# Altium project USB_Tool.PrjPcb
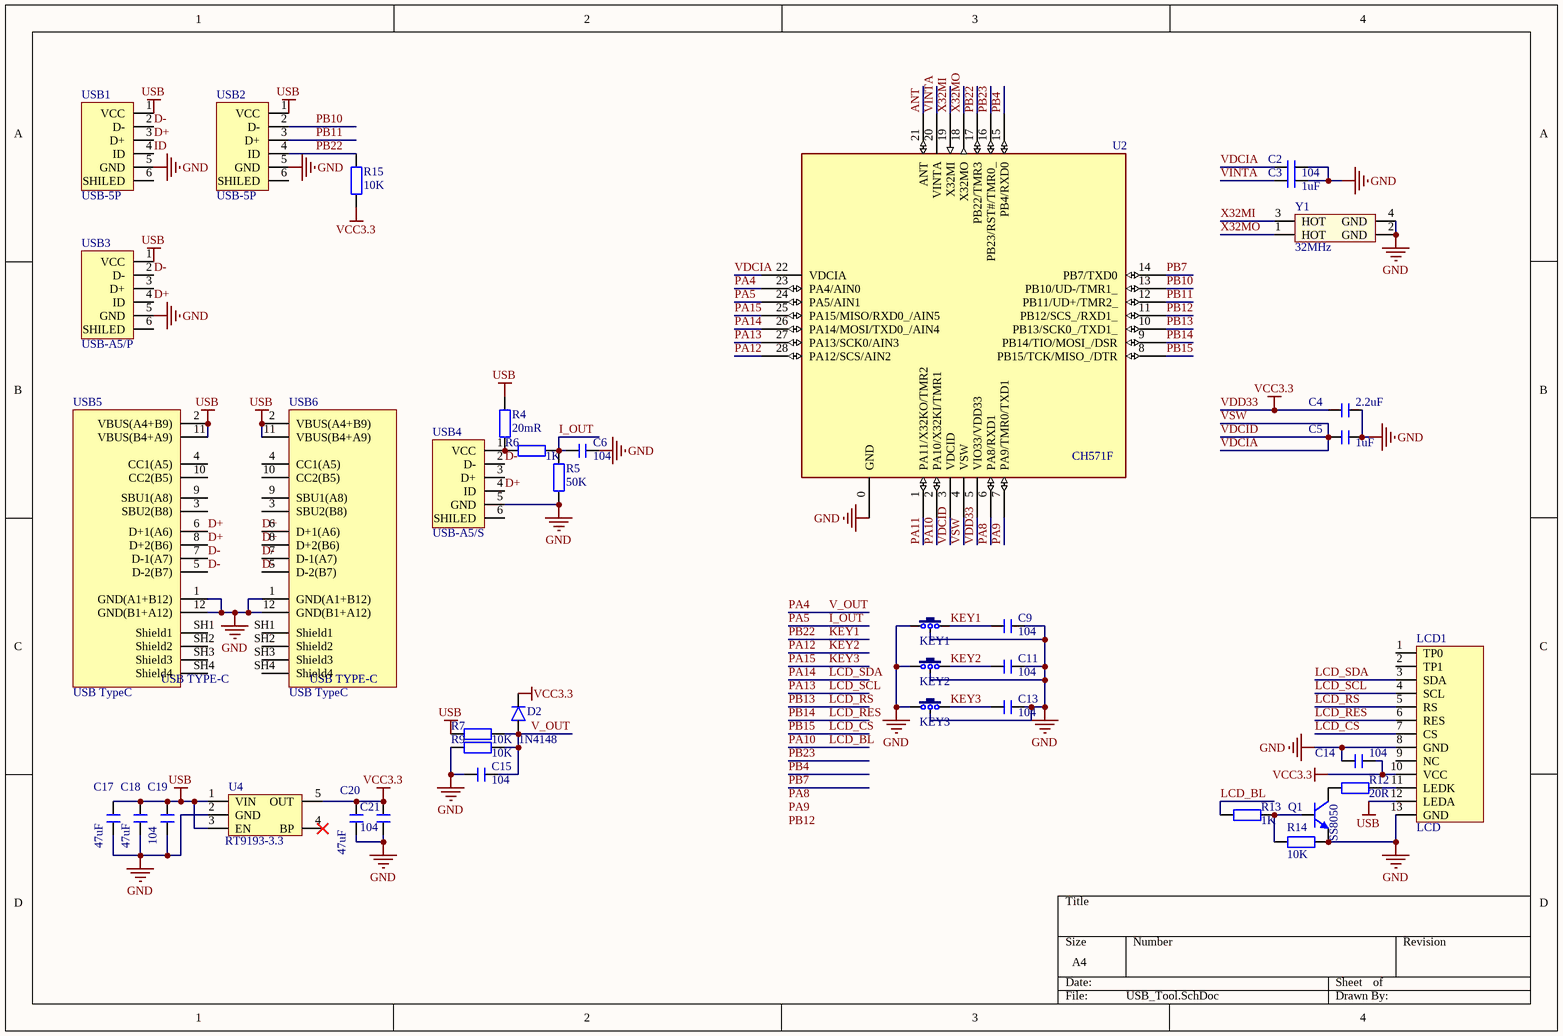
[diagram p0: USB_Tool.SchDoc]
1 sheet, 39 parts. Net scope: global (net labels, ports and power ports of the same name join across sheets).
Board file: USB_Tool.PcbDoc

## Sheet USB_Tool.SchDoc
size A4

### Parts
C2  104  [C 0603_L]
C3  1uF  [C 0603_L]
C4  2.2uF  [C 0603_L]
C5  1uF  [C 0603_L]
C6  104  [C 0603_L]
C9  104  [C 0603_L]
C11  104  [C 0603_L]
C13  104  [C 0603_L]
C14  104  [C 0603_L]
C15  104  [C 0603_L]
C17  47uF  [C 0603_L]
C18  47uF  [C 0603_L]
C19  104  [C 0603_L]
C20  47uF  [C 0603_L]
C21  104  [C 0603_L]
D2  1N4148  [SOD-323]
KEY1  KEY_3  [TSW 2*4*3.5-S-W]  (value not drawn)
KEY2  KEY_3  [TSW 2*4*3.5-S-W]  (value not drawn)
KEY3  KEY_3  [TSW 2*4*3.5-S-W]  (value not drawn)
LCD1  LCD  [0.96LCD]
Q1  SS8050  [SOT23-3N]
R4  20mR  [R 1206_L]
R5  50K  [R 0603_L]
R6  1K  [R 0603_L]
R7  10K  [R 0603_L]
R9  10K  [R 0603_L]
R12  20R  [R 0603_L]
R13  1K  [R 0603_L]
R14  10K  [R 0603_L]
R15  10K  [R 0603_L]
U2  CH571F  [QFN28_4X4]
U4  RT9193-3.3  [SOT23-5L]
USB1  USB-5P  [USB-micro_B]
USB2  USB-5P  [USB-micro_B]
USB3  USB-A5/P  [USB_A5/P_B]
USB4  USB-A5/S  [USB_A5/S_B]
USB5  USB TypeC  [USB Type-C]
USB6  USB TypeC  [USB Type-C]
Y1  32MHz  [OSC 3225-4P]

### Nets
GND: C2.2 C3.2 C4.2 C5.2 C6.2 C9.2 C11.2 C13.2 C14.2 C15.2 C17.2 C18.2 C19.2 C20.2 C21.2 KEY1.0 KEY1.1 KEY2.0 KEY2.1 KEY3.0 KEY3.1 LCD1.8(GND) LCD1.13(GND) Q1.2(E) R5.2 R9.2 R14.2 U2.0(GND) U4.2(GND) USB1.5(GND) USB2.5(GND) USB3.5(GND) USB4.5(GND) USB5.1(GND(A1+B12)) USB5.12(GND(B1+A12)) USB6.1(GND(A1+B12)) USB6.12(GND(B1+A12)) Y1.2(GND) Y1.4(GND)
USB: C17.1 C18.1 C19.1 LCD1.12(LEDA) R4.2 R7.2 U4.1(VIN) U4.3(EN) USB1.1(VCC) USB2.1(VCC) USB3.1(VCC) USB5.2(VBUS(A4+B9)) USB5.11(VBUS(B4+A9)) USB6.2(VBUS(A4+B9)) USB6.11(VBUS(B4+A9))
VDD33: C4.1 C14.1 C20.1 C21.1 D2.2 LCD1.10(VCC) R15.2 U2.5(VIO33/VDD33) U4.5(OUT)  [also labelled VCC3.3]
ANT: U2.21(ANT)
D+: USB1.3(D+) USB3.4(ID) USB4.4(ID) USB5.6(D+1(A6)) USB5.8(D+2(B6)) USB6.6(D+1(A6)) USB6.8(D+2(B6))
D-: USB1.2(D-) USB3.2(D-) USB4.2(D-) USB5.5(D-2(B7)) USB5.7(D-1(A7)) USB6.5(D-2(B7)) USB6.7(D-1(A7))
I_OUT: C6.1 R5.1 R6.2 U2.24(PA5/AIN1)  [also labelled PA5]
ID: USB1.4(ID)
KEY1: C9.1 KEY1.2 R15.1 U2.17(PB22/TMR3) USB2.4(ID)  [also labelled PB22]
KEY2: C11.1 KEY2.2 U2.28(PA12/SCS/AIN2)  [also labelled PA12]
KEY3: C13.1 KEY3.2 U2.25(PA15/MISO/RXD0_/AIN5)  [also labelled PA15]
LCD_BL: R13.1 U2.2(PA10/X32KI/TMR1)  [also labelled PA10]
LCD_CS: LCD1.7(CS) U2.8(PB15/TCK/MISO_/DTR)  [also labelled PB15]
LCD_RES: LCD1.6(RES) U2.9(PB14/TIO/MOSI_/DSR)  [also labelled PB14]
LCD_RS: LCD1.5(RS) U2.10(PB13/SCK0_/TXD1_)  [also labelled PB13]
LCD_SCL: LCD1.4(SCL) U2.27(PA13/SCK0/AIN3)  [also labelled PA13]
LCD_SDA: LCD1.3(SDA) U2.26(PA14/MOSI/TXD0_/AIN4)  [also labelled PA14]
PA4: C15.1 D2.1 R7.1 R9.1 U2.23(PA4/AIN0)  [also labelled V_OUT]
PA8: U2.6(PA8/RXD1)
PA9: U2.7(PA9/TMR0/TXD1)
PA11: U2.1(PA11/X32KO/TMR2)
PB4: U2.15(PB4/RXD0)
PB7: U2.14(PB7/TXD0)
PB10: U2.13(PB10/UD-/TMR1_) USB2.2(D-)
PB11: U2.12(PB11/UD+/TMR2_) USB2.3(D+)
PB12: U2.11(PB12/SCS_/RXD1_)
PB23: U2.16(PB23/RST#/TMR0_)
VDCIA: C2.1 C5.1 U2.3(VDCID) U2.4(VSW) U2.22(VDCIA)  [also labelled VDCID, VSW]
VINTA: C3.1 U2.20(VINTA)
X32MI: U2.19(X32MI) Y1.3(HOT)
X32MO: U2.18(X32MO) Y1.1(HOT)
NetLCD1_11: LCD1.11(LEDK) R12.2
NetQ1_1: Q1.1(B) R13.2 R14.1
NetQ1_3: Q1.3(C) R12.1
NetR4_1: R4.1 R6.1 USB4.1(VCC)

Not connected (* = marked no-connect by the designer): LCD1 1(TP0) 2(TP1) 9(NC); U4 4(BP)*; USB1 6(SHILED); USB2 6(SHILED); USB3 3(D+) 6(SHILED); USB4 3(D+) 6(SHILED); USB5 3(SBU2(B8)) 4(CC1(A5)) 9(SBU1(A8)) 10(CC2(B5)) SH1(Shield1) SH2(Shield2) SH3(Shield3) SH4(Shield4); USB6 3(SBU2(B8)) 4(CC1(A5)) 9(SBU1(A8)) 10(CC2(B5)) SH1(Shield1) SH2(Shield2) SH3(Shield3) SH4(Shield4)

### Notes on the sheet
- Labels drawn without touching a wire or pin: PA8, PA9, PB12
- (in symbol USB 2.0 Type C) USB TYPE-C

### Library data of the parts
C2-C5 = C: 无极性贴片电容; BOM名称: 无极性贴片电容
C6 C9 C11 C13 C15 C17-C21 = C: 无极性贴片电容; 版权归属: 正点原子; BOM名称: 无极性贴片电容; 学习资源: www.openedv.com
C14 = C: 无极性电容; BOM名称: 无极性贴片电容; 版权归属: 正点原子; 学习资源: www.openedv.com
D2 = D: 二极管
KEY1-KEY3 = KEY_3: 侧按键; BOM名称: 3x6轻触开关; 版权归属: 正点原子; Parameter: 按键/开关; 学习资源: www.openedv.com
LCD1 = LCD 0.96: 0.96 LCD 80*160; BOM名称: 12864 点阵屏; 版权归属: 正点原子; Parameter: 显示器件; 学习资源: www.openedv.com
Q1 = 8050-SMD: 高频放大-NPN型; 版权归属: 正点原子; 属性: 40V 1.5A 1W 100MHZ; Parameter: 三极管; BOM名称: 高频放大-NPN型; 学习资源: www.openedv.com
R4-R7 R9 R12-R15 = R: 贴片电阻
U2 = CH571F: RISC-V MCU with BLE/USB/ADC/SPI/2*UART
U4 = LDO RT9193: LDO; BOM名称: 稳压芯片; 版权归属: 正点原子; 学习资源: www.openedv.com
USB1-USB4 = USB 2.0 micro B: micro_USB母座; BOM名称: 微型USB母座; 版权归属: 正点原子; Parameter: 接口器件; 学习资源: www.openedv.com
USB5 USB6 = USB 2.0 Type C: 12P TypeC 母座; 版权归属: 正点原子; Parameter: 接口器件; 学习资源: www.openedv.com
Y1 = Y-3225-4P: 晶振25MHz; Published: 8-Jun-2000; LatestRevisionDate: 17-Jul-2002; LatestRevisionNote: Re-released for DXP Platform.; Publisher: Altium Limited